# Altium project VIRB.PrjPcb
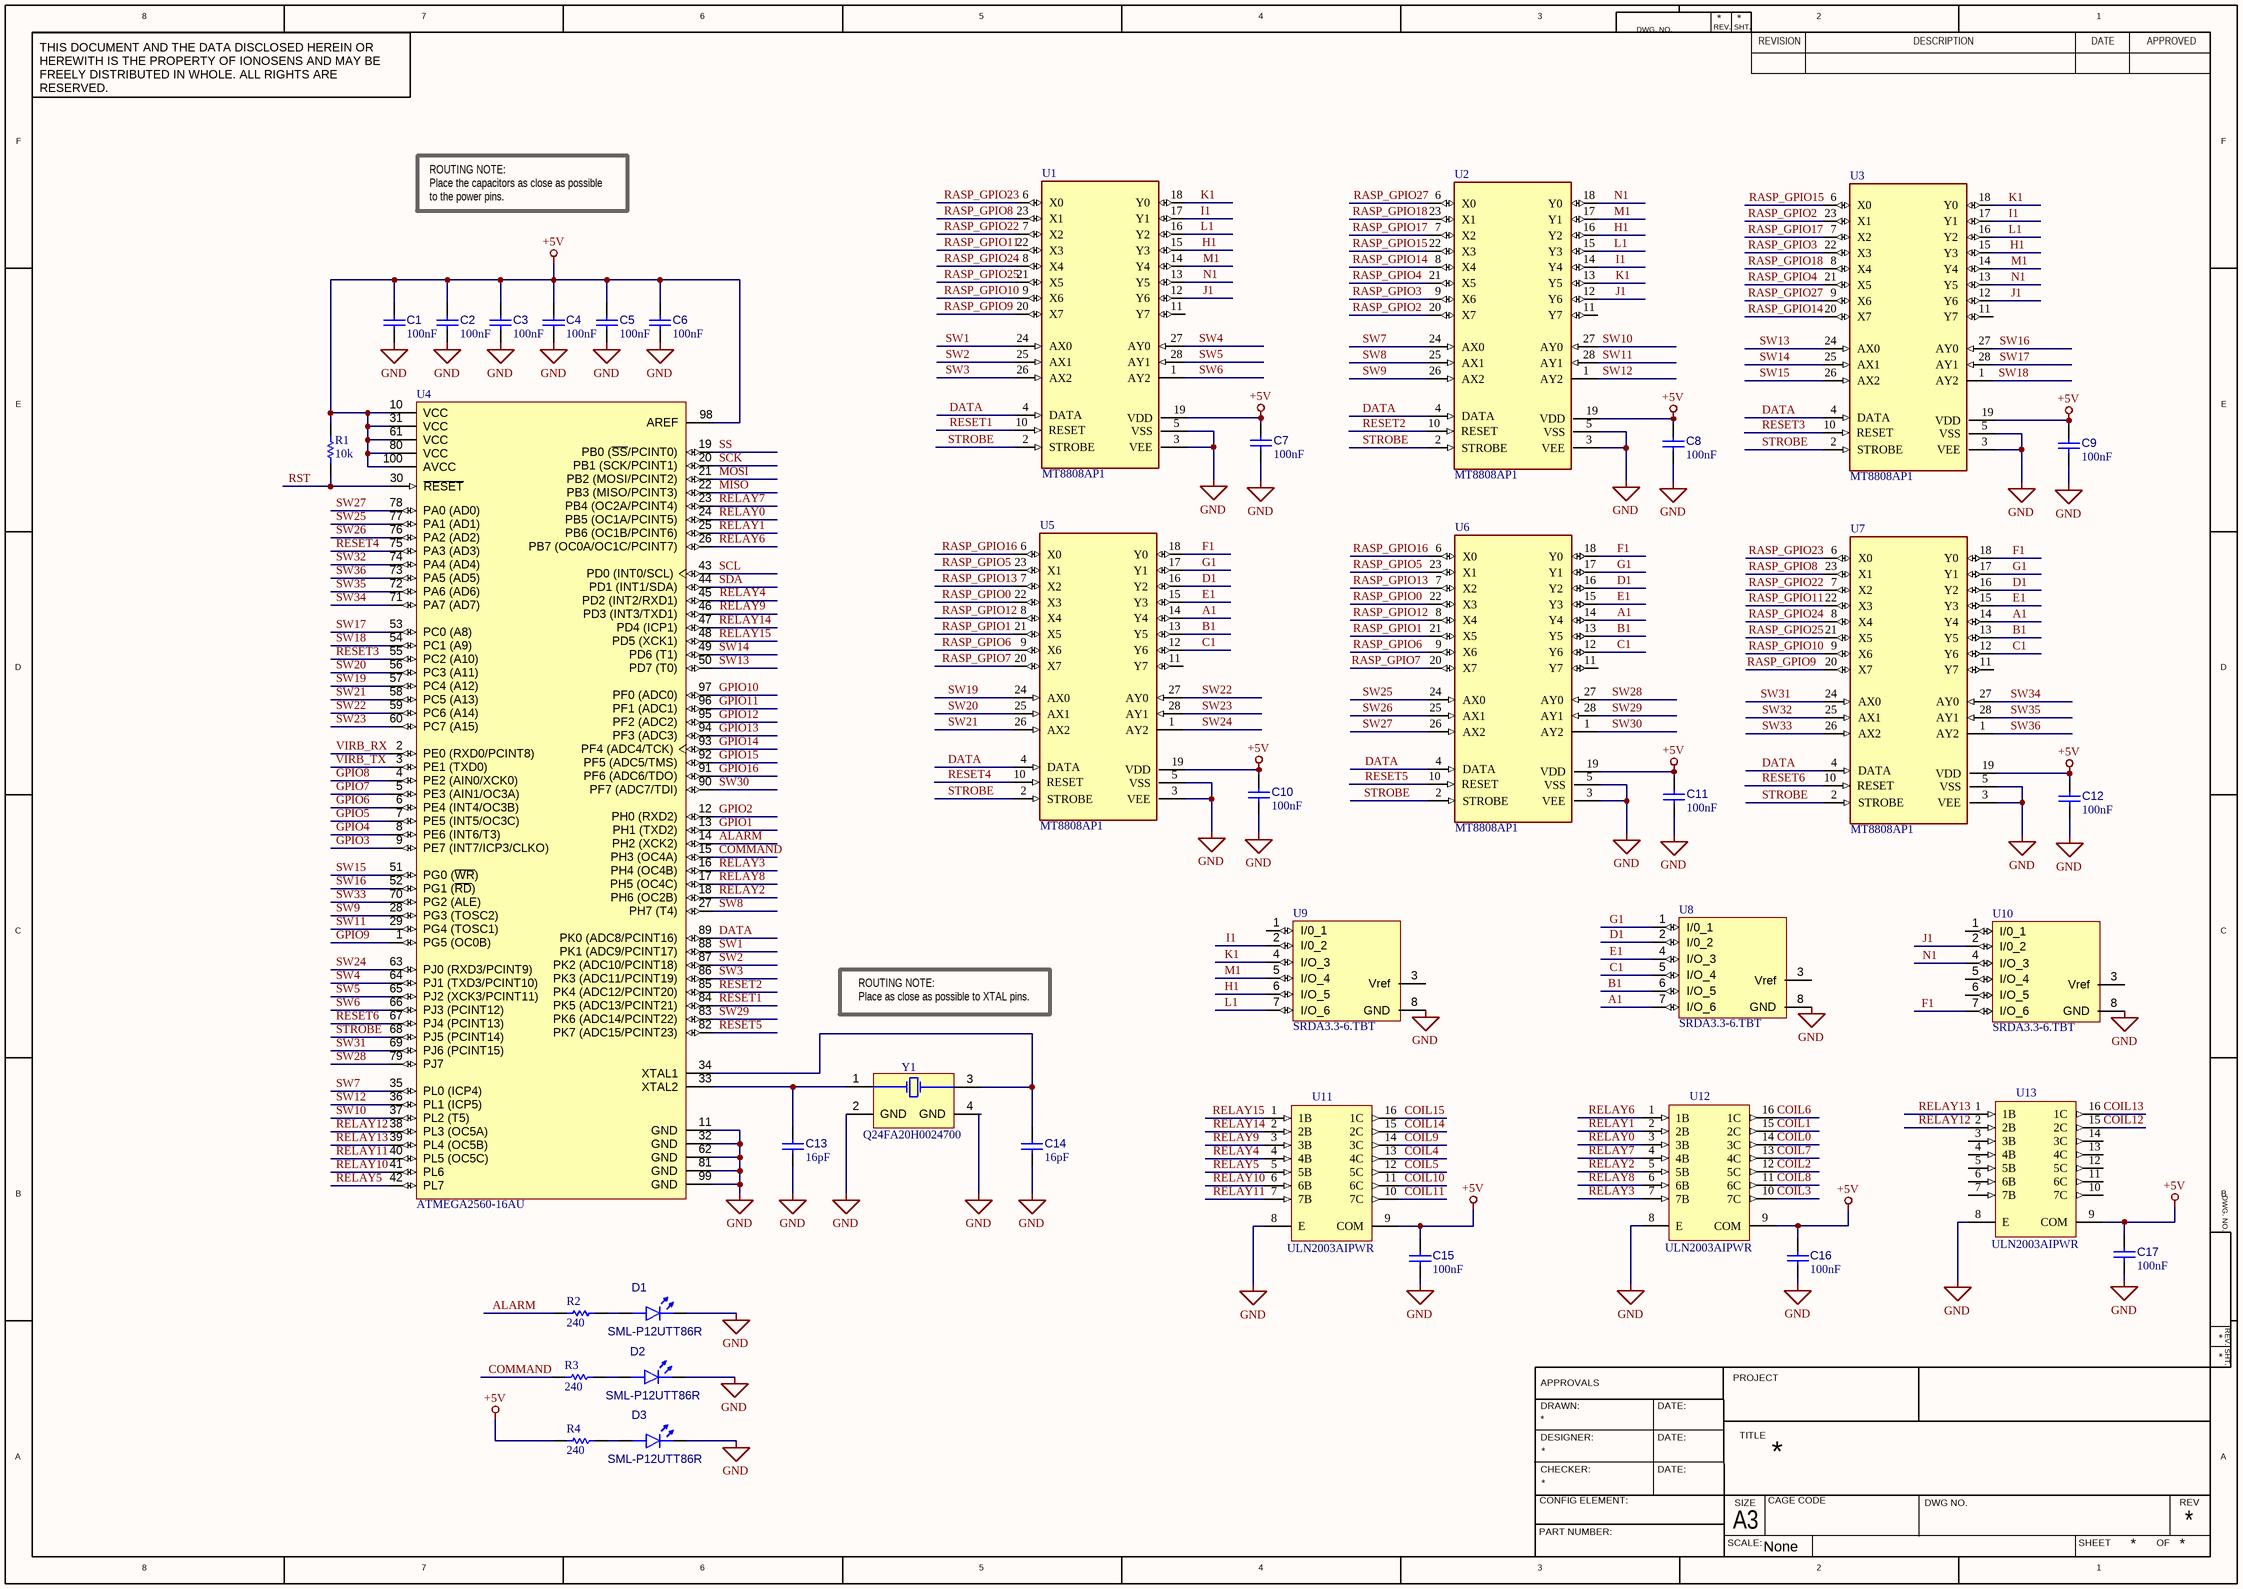
[diagram p0: Sheet1.SchDoc]
3 sheets, 103 parts. Net scope: global (net labels, ports and power ports of the same name join across sheets).
Board file: PCB1.PcbDoc
Sheets:
  Sheet1.SchDoc
  Sheet2.SchDoc
  Sheet3.SchDoc

## Sheet Sheet1.SchDoc
size 420 x 297 mm; Scale: None

### Parts
C1  value 100nF  [CAPC1005X06M]  (hidden comment: CC0402JRX7R7BB104)
C2  value 100nF  [CAPC1005X06M]  (hidden comment: CC0402JRX7R7BB104)
C3  value 100nF  [CAPC1005X06M]  (hidden comment: CC0402JRX7R7BB104)
C4  value 100nF  [CAPC1005X06M]  (hidden comment: CC0402JRX7R7BB104)
C5  value 100nF  [CAPC1005X06M]  (hidden comment: CC0402JRX7R7BB104)
C6  value 100nF  [CAPC1005X06M]  (hidden comment: CC0402JRX7R7BB104)
C7  value 100nF  [CAPC1005X06M]  (hidden comment: CC0402JRX7R7BB104)
C8  value 100nF  [CAPC1005X06M]  (hidden comment: CC0402JRX7R7BB104)
C9  value 100nF  [CAPC1005X06M]  (hidden comment: CC0402JRX7R7BB104)
C10  value 100nF  [CAPC1005X06M]  (hidden comment: CC0402JRX7R7BB104)
C11  value 100nF  [CAPC1005X06M]  (hidden comment: CC0402JRX7R7BB104)
C12  value 100nF  [CAPC1005X06M]  (hidden comment: CC0402JRX7R7BB104)
C13  value 16pF  [CAPC1005X06M]  (hidden comment: CC0402JRNPO9BN160)
C14  value 16pF  [CAPC1005X06M]  (hidden comment: CC0402JRNPO9BN160)
C15  value 100nF  [CAPC1005X06M]  (hidden comment: CC0402JRX7R7BB104)
C16  value 100nF  [CAPC1005X06M]  (hidden comment: CC0402JRX7R7BB104)
C17  value 100nF  [CAPC1005X06M]  (hidden comment: CC0402JRX7R7BB104)
D1  SML-P12UTT86R  [DIOC1005X02R]
D2  SML-P12UTT86R  [DIOC1005X02R]
D3  SML-P12UTT86R  [DIOC1005X02R]
R1  value 10k  [RESC1005X04M]  (hidden comment: AC0402FR-0710KL)
R2  value 240  [RESC1005X04M]  (hidden comment: AC0402FR-07240RL)
R3  value 240  [RESC1005X04M]  (hidden comment: AC0402FR-07240RL)
R4  value 240  [RESC1005X04M]  (hidden comment: AC0402FR-07240RL)
U1  MT8808AP1  [PLCC127P1244X1244X457-28M]
U2  MT8808AP1  [PLCC127P1244X1244X457-28M]
U3  MT8808AP1  [PLCC127P1244X1244X457-28M]
U4  ATMEGA2560-16AU  [ATML-100A_M]
U5  MT8808AP1  [PLCC127P1244X1244X457-28M]
U6  MT8808AP1  [PLCC127P1244X1244X457-28M]
U7  MT8808AP1  [PLCC127P1244X1244X457-28M]
U8  SRDA3.3-6.TBT  [SOIC127P600X175-8M]
U9  SRDA3.3-6.TBT  [SOIC127P600X175-8M]
U10  SRDA3.3-6.TBT  [SOIC127P600X175-8M]
U11  ULN2003AIPWR  [TSOP65P640X120-16M]
U12  ULN2003AIPWR  [TSOP65P640X120-16M]
U13  ULN2003AIPWR  [TSOP65P640X120-16M]
Y1  Q24FA20H0024700  [FA-20H]

### Nets
+5V: C1.2 C2.2 C3.2 C4.2 C5.2 C6.2 C7.2 C8.2 C9.2 C10.2 C11.2 C12.2 C15.2 C16.2 C17.2 R1.2 R4.1 U1.19(VDD) U2.19(VDD) U3.19(VDD) U4.10(VCC) U4.31(VCC) U4.61(VCC) U4.80(VCC) U4.98(AREF) U4.100(AVCC) U5.19(VDD) U6.19(VDD) U7.19(VDD) U11.9(COM) U12.9(COM) U13.9(COM)
GND: C1.1 C2.1 C3.1 C4.1 C5.1 C6.1 C7.1 C8.1 C9.1 C10.1 C11.1 C12.1 C13.1 C14.1 C15.1 C16.1 C17.1 D1.1(K) D2.1(K) D3.1(K) U1.3(VEE) U1.5(VSS) U2.3(VEE) U2.5(VSS) U3.3(VEE) U3.5(VSS) U4.11(GND) U4.32(GND) U4.62(GND) U4.81(GND) U4.99(GND) U5.3(VEE) U5.5(VSS) U6.3(VEE) U6.5(VSS) U7.3(VEE) U7.5(VSS) U8.8(GND) U9.8(GND) U10.8(GND) U11.8(E) U12.8(E) U13.8(E) Y1.2(GND) Y1.4(GND)
A1: U5.14(Y4) U6.14(Y4) U7.14(Y4) U8.7(I/O_6)
ALARM: R2.1 U4.14(PH2_(XCK2))
B1: U5.13(Y5) U6.13(Y5) U7.13(Y5) U8.6(I/O_5)
C1: U5.12(Y6) U6.12(Y6) U7.12(Y6) U8.5(I/O_4)
COIL0: U12.14(3C)
COIL1: U12.15(2C)
COIL2: U12.12(5C)
COIL3: U12.10(7C)
COIL4: U11.13(4C)
COIL5: U11.12(5C)
COIL6: U12.16(1C)
COIL7: U12.13(4C)
COIL8: U12.11(6C)
COIL9: U11.14(3C)
COIL10: U11.11(6C)
COIL11: U11.10(7C)
COIL12: U13.15(2C)
COIL13: U13.16(1C)
COIL14: U11.15(2C)
COIL15: U11.16(1C)
COMMAND: R3.1 U4.15(PH3_(OC4A))
D1: U5.16(Y2) U6.16(Y2) U7.16(Y2) U8.2(I/0_2)
DATA: U1.4(DATA) U2.4(DATA) U3.4(DATA) U4.89(PK0_(ADC8/PCINT16)) U5.4(DATA) U6.4(DATA) U7.4(DATA)
E1: U5.15(Y3) U6.15(Y3) U7.15(Y3) U8.4(I/O_3)
F1: U5.18(Y0) U6.18(Y0) U7.18(Y0) U10.7(I/O_6)
G1: U5.17(Y1) U6.17(Y1) U7.17(Y1) U8.1(I/0_1)
GPIO1: U4.13(PH1_(TXD2))
GPIO2: U4.12(PH0_(RXD2))
GPIO3: U4.9(PE7_(INT7/ICP3/CLKO))
GPIO4: U4.8(PE6_(INT6/T3))
GPIO5: U4.7(PE5_(INT5/OC3C))
GPIO6: U4.6(PE4_(INT4/OC3B))
GPIO7: U4.5(PE3_(AIN1/OC3A))
GPIO8: U4.4(PE2_(AIN0/XCK0))
GPIO9: U4.1(PG5_(OC0B))
GPIO10: U4.97(PF0_(ADC0))
GPIO11: U4.96(PF1_(ADC1))
GPIO12: U4.95(PF2_(ADC2))
GPIO13: U4.94(PF3_(ADC3))
GPIO14: U4.93(PF4_(ADC4/TCK))
GPIO15: U4.92(PF5_(ADC5/TMS))
GPIO16: U4.91(PF6_(ADC6/TDO))
H1: U1.15(Y3) U2.16(Y2) U3.15(Y3) U9.6(I/O_5)
I1: U1.17(Y1) U2.14(Y4) U3.17(Y1) U9.2(I/0_2)
J1: U1.12(Y6) U2.12(Y6) U3.12(Y6) U10.2(I/0_2)
K1: U1.18(Y0) U2.13(Y5) U3.18(Y0) U9.4(I/O_3)
L1: U1.16(Y2) U2.15(Y3) U3.16(Y2) U9.7(I/O_6)
M1: U1.14(Y4) U2.17(Y1) U3.14(Y4) U9.5(I/O_4)
MISO: U4.22(PB3_(MISO/PCINT3))
MOSI: U4.21(PB2_(MOSI/PCINT2))
N1: U1.13(Y5) U2.18(Y0) U3.13(Y5) U10.4(I/O_3)
RASP_GPIO0: U5.22(X3) U6.22(X3)
RASP_GPIO1: U5.21(X5) U6.21(X5)
RASP_GPIO2: U2.20(X7) U3.23(X1)
RASP_GPIO3: U2.9(X6) U3.22(X3)
RASP_GPIO4: U2.21(X5) U3.21(X5)
RASP_GPIO5: U5.23(X1) U6.23(X1)
RASP_GPIO6: U5.9(X6) U6.9(X6)
RASP_GPIO7: U5.20(X7) U6.20(X7)
RASP_GPIO8: U1.23(X1) U7.23(X1)
RASP_GPIO9: U1.20(X7) U7.20(X7)
RASP_GPIO10: U1.9(X6) U7.9(X6)
RASP_GPIO11: U1.22(X3) U7.22(X3)
RASP_GPIO12: U5.8(X4) U6.8(X4)
RASP_GPIO13: U5.7(X2) U6.7(X2)
RASP_GPIO14: U2.8(X4) U3.20(X7)
RASP_GPIO15: U2.22(X3) U3.6(X0)
RASP_GPIO16: U5.6(X0) U6.6(X0)
RASP_GPIO17: U2.7(X2) U3.7(X2)
RASP_GPIO18: U2.23(X1) U3.8(X4)
RASP_GPIO22: U1.7(X2) U7.7(X2)
RASP_GPIO23: U1.6(X0) U7.6(X0)
RASP_GPIO24: U1.8(X4) U7.8(X4)
RASP_GPIO25: U1.21(X5) U7.21(X5)
RASP_GPIO27: U2.6(X0) U3.9(X6)
RELAY0: U4.24(PB5_(OC1A/PCINT5)) U12.3(3B)
RELAY1: U4.25(PB6_(OC1B/PCINT6)) U12.2(2B)
RELAY2: U4.18(PH6_(OC2B)) U12.5(5B)
RELAY3: U4.16(PH4_(OC4B)) U12.7(7B)
RELAY4: U4.45(PD2_(INT2/RXD1)) U11.4(4B)
RELAY5: U4.42(PL7) U11.5(5B)
RELAY6: U4.26(PB7_(OC0A/OC1C/PCINT7)) U12.1(1B)
RELAY7: U4.23(PB4_(OC2A/PCINT4)) U12.4(4B)
RELAY8: U4.17(PH5_(OC4C)) U12.6(6B)
RELAY9: U4.46(PD3_(INT3/TXD1)) U11.3(3B)
RELAY10: U4.41(PL6) U11.6(6B)
RELAY11: U4.40(PL5_(OC5C)) U11.7(7B)
RELAY12: U4.38(PL3_(OC5A)) U13.2(2B)
RELAY13: U4.39(PL4_(OC5B)) U13.1(1B)
RELAY14: U4.47(PD4_(ICP1)) U11.2(2B)
RELAY15: U4.48(PD5_(XCK1)) U11.1(1B)
RESET1: U1.10(RESET) U4.84(PK5_(ADC13/PCINT21))
RESET2: U2.10(RESET) U4.85(PK4_(ADC12/PCINT20))
RESET3: U3.10(RESET) U4.55(PC2_(A10))
RESET4: U4.75(PA3_(AD3)) U5.10(RESET)
RESET5: U4.82(PK7_(ADC15/PCINT23)) U6.10(RESET)
RESET6: U4.67(PJ4_(PCINT13)) U7.10(RESET)
RST: R1.1 U4.30(~{RESET})
SCK: U4.20(PB1_(SCK/PCINT1))
SCL: U4.43(PD0_(INT0/SCL))
SDA: U4.44(PD1_(INT1/SDA))
SS: U4.19(PB0_(~{SS}/PCINT0))
STROBE: U1.2(STROBE) U2.2(STROBE) U3.2(STROBE) U4.68(PJ5_(PCINT14)) U5.2(STROBE) U6.2(STROBE) U7.2(STROBE)
SW1: U1.24(AX0) U4.88(PK1_(ADC9/PCINT17))
SW2: U1.25(AX1) U4.87(PK2_(ADC10/PCINT18))
SW3: U1.26(AX2) U4.86(PK3_(ADC11/PCINT19))
SW4: U1.27(AY0) U4.64(PJ1_(TXD3/PCINT10))
SW5: U1.28(AY1) U4.65(PJ2_(XCK3/PCINT11))
SW6: U1.1(AY2) U4.66(PJ3_(PCINT12))
SW7: U2.24(AX0) U4.35(PL0_(ICP4))
SW8: U2.25(AX1) U4.27(PH7_(T4))
SW9: U2.26(AX2) U4.28(PG3_(TOSC2))
SW10: U2.27(AY0) U4.37(PL2_(T5))
SW11: U2.28(AY1) U4.29(PG4_(TOSC1))
SW12: U2.1(AY2) U4.36(PL1_(ICP5))
SW13: U3.24(AX0) U4.50(PD7_(T0))
SW14: U3.25(AX1) U4.49(PD6_(T1))
SW15: U3.26(AX2) U4.51(PG0_(~{WR}))
SW16: U3.27(AY0) U4.52(PG1_(~{RD}))
SW17: U3.28(AY1) U4.53(PC0_(A8))
SW18: U3.1(AY2) U4.54(PC1_(A9))
SW19: U4.57(PC4_(A12)) U5.24(AX0)
SW20: U4.56(PC3_(A11)) U5.25(AX1)
SW21: U4.58(PC5_(A13)) U5.26(AX2)
SW22: U4.59(PC6_(A14)) U5.27(AY0)
SW23: U4.60(PC7_(A15)) U5.28(AY1)
SW24: U4.63(PJ0_(RXD3/PCINT9)) U5.1(AY2)
SW25: U4.77(PA1_(AD1)) U6.24(AX0)
SW26: U4.76(PA2_(AD2)) U6.25(AX1)
SW27: U4.78(PA0_(AD0)) U6.26(AX2)
SW28: U4.79(PJ7) U6.27(AY0)
SW29: U4.83(PK6_(ADC14/PCINT22)) U6.28(AY1)
SW30: U4.90(PF7_(ADC7/TDI)) U6.1(AY2)
SW31: U4.69(PJ6_(PCINT15)) U7.24(AX0)
SW32: U4.74(PA4_(AD4)) U7.25(AX1)
SW33: U4.70(PG2_(ALE)) U7.26(AX2)
SW34: U4.71(PA7_(AD7)) U7.27(AY0)
SW35: U4.72(PA6_(AD6)) U7.28(AY1)
SW36: U4.73(PA5_(AD5)) U7.1(AY2)
VIRB_RX: U4.2(PE0_(RXD0/PCINT8))
VIRB_TX: U4.3(PE1_(TXD0))
NetC13_2: C13.2 U4.33(XTAL2) Y1.1(X1)
NetC14_2: C14.2 U4.34(XTAL1) Y1.3(X2)
NetD1_2: D1.2(A) R2.2
NetD2_2: D2.2(A) R3.2
NetD3_2: D3.2(A) R4.2

Not connected (* = marked no-connect by the designer): U1 11(Y7); U2 11(Y7); U3 11(Y7); U5 11(Y7); U6 11(Y7); U7 11(Y7); U8 3(Vref); U9 1(I/0_1) 3(Vref); U10 1(I/0_1) 3(Vref) 5(I/O_4) 6(I/O_5); U13 3(3B) 4(4B) 5(5B) 6(6B) 7(7B) 10(7C) 11(6C) 12(5C) 13(4C) 14(3C)

### Notes on the sheet
- ROUTING NOTE:
  Place the capacitors as close as possible to the power pins.
- ROUTING NOTE:
  Place as close as possible to XTAL pins.
- 8
- 7
- 6
- 5
- 4
- 3
- DWG. NO.
- REV.
- SHT.
- REVISION
- 2
- DESCRIPTION
- DATE
- 1
- APPROVED
- THIS DOCUMENT AND THE DATA DISCLOSED HEREIN OR HEREWITH IS THE PROPERTY OF IONOSENS AND MAY BE FREELY DISTRIBUTED IN WHOLE. ALL RIGHTS ARE RESERVED.
- F
- E
- D
- C
- B
- DRAWN:
- APPROVALS
- DATE:
- PROJECT
- A
- CHECKER:
- DESIGNER:
- TITLE
- PART NUMBER:
- CONFIG ELEMENT:
- SCALE:
- A3
- SIZE
- CAGE CODE
- DWG NO.
- SHEET
- OF
- REV

### Library data of the parts
C1-C12 C15-C17 = C01-0402-01-00001-1: Cap Ceramic 100nF 50V X7R 5% SMD 0402 125°C; Manufacturer: YAGEO; Voltage Rating: 16V; Case/Package: 0402; Capacitor Type: Ceramic; Min Operating Temperature: -55°C; Width: 508µm; Length: 1mm; Tolerance: 5%; Dielectric: X7R; RoHS Compliant: Yes; Pins: 2; Composition: Ceramic; Depth: 500µm; Voltage Rating (DC): 16V; Mount: Surface Mount; Mounting Technology: Surface Mount; Termination: SMD/SMT; Manufacturer P/N: CC0402JRX7R7BB104; Thickness: 558.8µm; Max Operating Temperature: 125°C
C13 C14 = C01-0402-01-00000-2: Cap Ceramic 16pF 50V C0G 5% SMD 0402 125°C; Manufacturer: YAGEO; Dielectric: COG; Depth: 500µm; Mount: Surface Mount; Voltage Rating (DC): 50V; Width: 508µm; Pins: 2; Manufacturer P/N: CC0402JRNPO9BN160; Length: 990.6µm; Composition: Ceramic; Thickness: 558.8µm; Mounting Technology: Surface Mount; RoHS Compliant: Yes; Voltage Rating: 50V; Termination: SMD/SMT; Tolerance: 5%; Capacitor Type: Ceramic; Min Operating Temperature: -55°C; Max Operating Temperature: 125°C; Case/Package: 0402
D1-D3 = D01-0402-01-00001-1: Led red 0402; Manufacturer: ROHM; Number of LEDs: 1; Max Power Dissipation: 52mW; Luminous Intensity: 85 mcd; Dominant Wavelength: 620 nm; Lens Style: Rectangular, Square; Forward Current: 20 mA; Forward Voltage: 2V; Mounting Technology: SMD; Case/Package: 0402; Min Operating Temperature: -40°C; Max Operating Temperature: 85°C; Manufacturer P/N: SML-P12UTT86R; Colour: red; RoHS Compliant: Yes; Pins: 2
R1 = R01-0402-01-00169-2: RES SMD 10K OHM 1% 1/16W 0402; Manufacturer: Yageo; Temperature Coefficient: 100 ppm/ºC; Power Rating: 62.5mW; Voltage Rating: 50V; Length: 990.6µm; Height: 370µm; Min Operating Temperature: -55°C; Case/Package: 0402; Features: Automotive AEC-Q200, Moisture Resistant; Packaging: Tape & Reel; Width: 508µm; Manufacturer P/N: AC0402FR-0710KL; RoHS: Yes; Max Operating Temperature: 155°C; Tolerance: 1%; Composition: Thick Film; Number of Terminations: 2
R2-R4 = R01-0402-01-00437-2: RES SMD 240 OHM 1% 1/16W 0402; Manufacturer: Yageo; Temperature Coefficient: 100 ppm/ºC; Power Rating: 62.5mW; Voltage Rating: 50V; Packaging: Tape & Reel; Manufacturer P/N: AC0402FR-07240RL; Height: 370µm; Case/Package: 0402; Composition: Thick Film; Max Operating Temperature: 155°C; Number of Terminations: 2; RoHS: Yes; Min Operating Temperature: -55°C; Tolerance: 1%; Width: 508µm; Length: 990.6µm; Features: Automotive AEC-Q200, Moisture Resistant
U1-U3 U5-U7 = CMP-0007-0001-00001-1: 8 x 8 Analog Switch Array with Low On-resistance, for (VDD - VEE) = 4.5 to 13.2V; Manufacturer: Microchip; Number of Inputs: 8; Max Supply Voltage: 85V; On-State Resistance: 65; Min Supply Voltage: 4.5; Output Current: 15mA; Number of Outputs: 8; Length: 11.58mm; Manufacturer P/N: MT8808AP1; Mounting Technology: SMD; Pins: 28; Max Operating Temperature: 13.2°C; Number of Elements: 8; Min Operating Temperature: -40°C; Width: 11.58mm; Height: 4.57mm; RoHS Compliant: yes; Case/Package: PLLC
U4 = U01-0007-01-00000-1: AVR ATmega Microcontroller 8-bit 16MHz 256KB FLASH TQFP100; Manufacturer: Microchip; Oscillator Type: External; Interface: I2C, SPI, UART; Minimum Supply Voltage: 4.5V; Peripherals: Brown-out Detect/Reset, POR, PWM, WDT; Number of A/D: 1 AD / 16 channels; Watchdog Timer: Yes; Number of I/O: 86; RAM Size: 8KB; Max Supply Voltage: 5.5V; Max Operating Temperature: 85°C; Manufacturer P/N: ATMEGA2560-16AU; Memory Size: 256KB; Mounting Technology: SMD; Memory Type: FLASH; Pins: 100; Height: 1.2mm; Case/Package: A; RoHS: Yes; Min Operating Temperature: -40°C; Max Frequency: 16MHz; Number of Programmable I/O: 86; Contact Plating: Tin; Core Architecture: AVR; Frequency: 16MHz; Width: 16.25mm
U8-U10 = CMP-0005-0001-00000-1: SRDA Series 15 V 8 pF SMT RailClamp® Low Capacitance TVS Diode Array - SOIC-8; Manufacturer: Semtech; Number of Channels: 6; Peak Pulse Current: 25A; Max Breakdown Voltage: 6V; Max Power Dissipation: 500W; Direction: Unidirectional; Clamping Voltage: 15V; Capacitance: 8pF; Breakdown Voltage: 3.2V; Leakage Current: 1µV; Manufacturer P/N: SRDA3.3-6.TBT; Height: 1.75mm; Case/Package: so-8; Pins: 8; Length: 5mm; Min Operating Temperature: -55°C; Mounting Technology: SMD; Max Operating Temperature: 125°C; RoHS Compliant: yes; Width: 4mm
U11-U13 = CMP-0005-0001-00001-1: 50-V, 7-ch darlington transistor array, -40 to 105C 16-TSSOP -40 to 105; Manufacturer: Texas Instruments; Voltage Rating: 50V; Min Operating Temperature: 105°C; RoHS Compliant: yes; Pins: 16; Case/Package: TSSOP; Mounting Technology: SMD; Length: 5mm; Manufacturer P/N: ULN2003AIPWR; Height: 1.2mm; Max Operating Temperature: -40°C; Width: 4.4mm
Y1 = Y01-0001-01-00000-11: 16MHz ±10ppm 16pF 80Ω SMD-2520_4P; Manufacturer: SEIKO-EPSON; ESR: 80; RoHS Compliant: yes; Min Operating Temperature: -40°C; Load Capacitance: 16pF; Mounting Technology: SMD; Pins: 4; Case/Package: SMD-2520_4P; Max Operating Temperature: 85°C; Frequency: 16MHz; Manufacturer P/N: Q24FA20H0024700

## Sheet Sheet2.SchDoc
size 420 x 297 mm
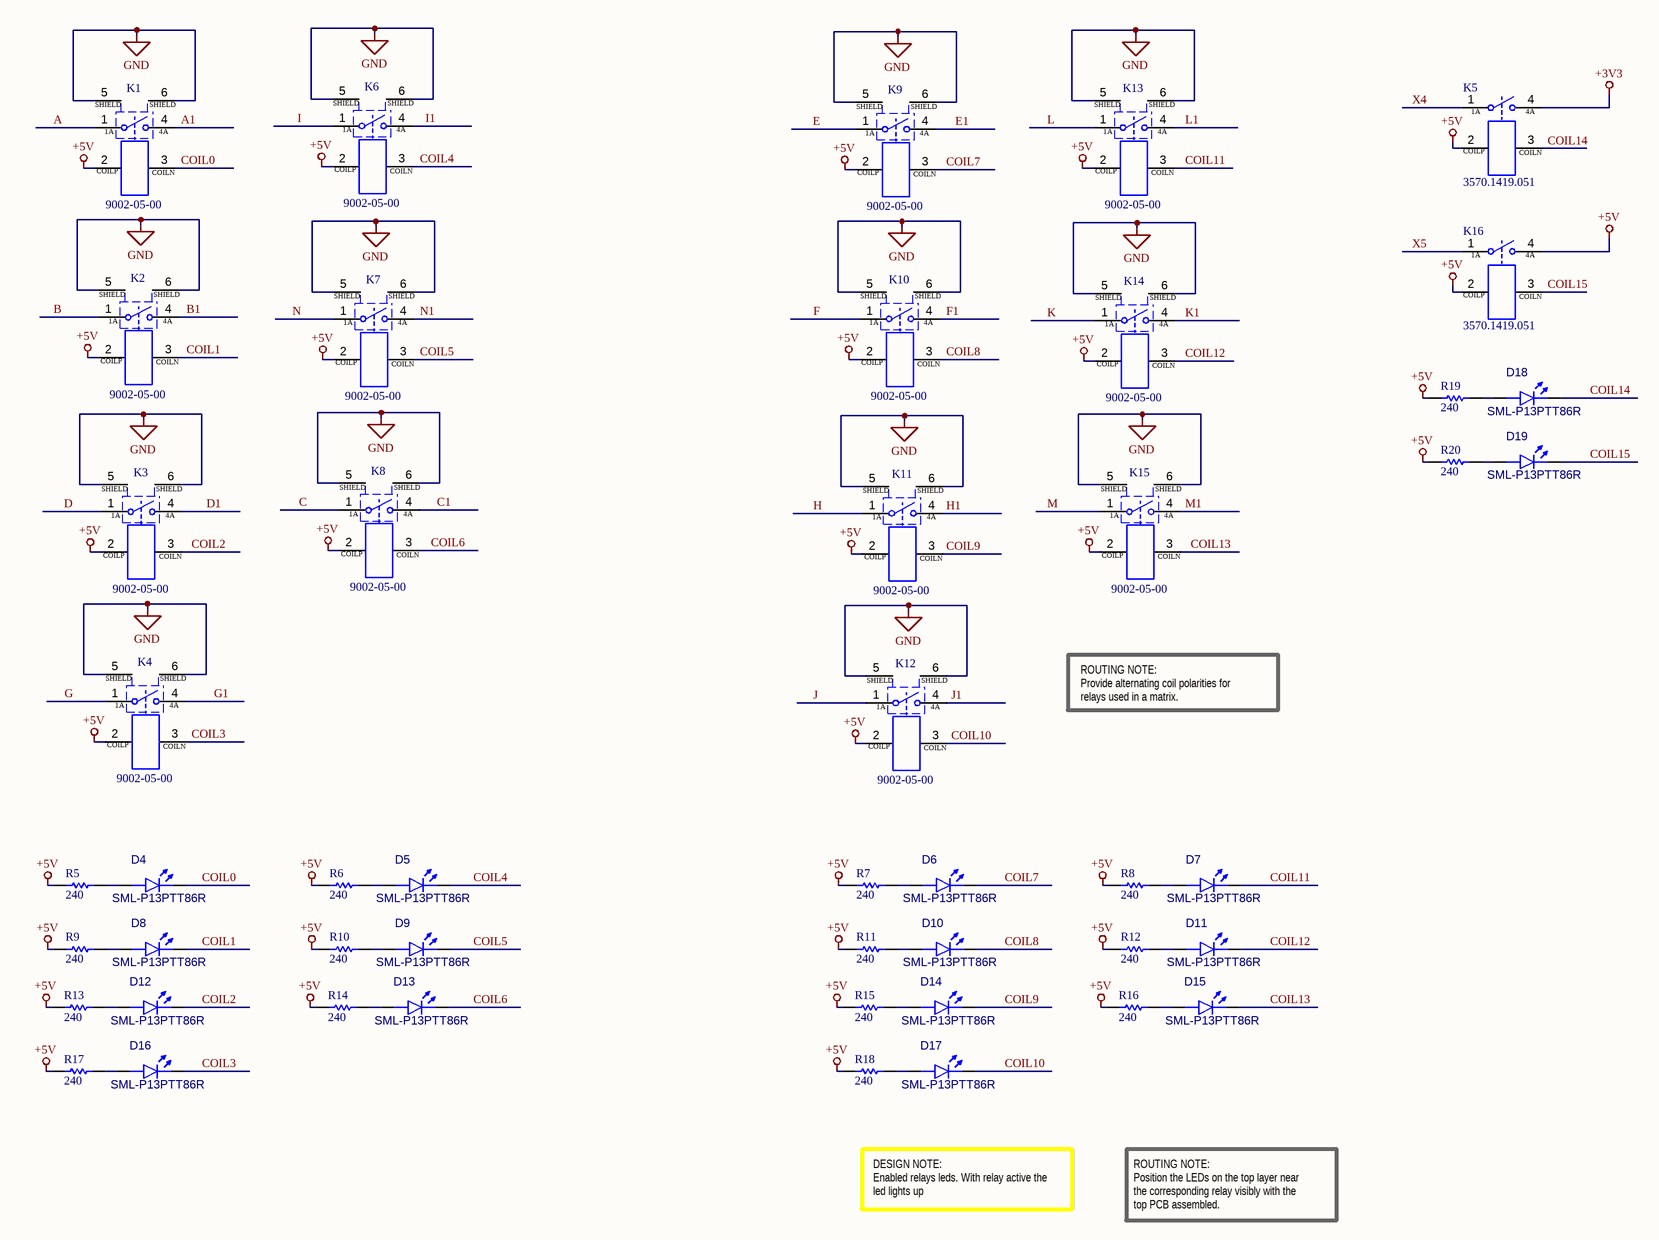
[diagram p1: Sheet2.SchDoc]

### Parts
D4  SML-P13PTT86R  [DIOC1005X02R]
D5  SML-P13PTT86R  [DIOC1005X02R]
D6  SML-P13PTT86R  [DIOC1005X02R]
D7  SML-P13PTT86R  [DIOC1005X02R]
D8  SML-P13PTT86R  [DIOC1005X02R]
D9  SML-P13PTT86R  [DIOC1005X02R]
D10  SML-P13PTT86R  [DIOC1005X02R]
D11  SML-P13PTT86R  [DIOC1005X02R]
D12  SML-P13PTT86R  [DIOC1005X02R]
D13  SML-P13PTT86R  [DIOC1005X02R]
D14  SML-P13PTT86R  [DIOC1005X02R]
D15  SML-P13PTT86R  [DIOC1005X02R]
D16  SML-P13PTT86R  [DIOC1005X02R]
D17  SML-P13PTT86R  [DIOC1005X02R]
D18  SML-P13PTT86R  [DIOC1005X02R]
D19  SML-P13PTT86R  [DIOC1005X02R]
K1  9002-05-00  [SIP564W40P254L1980H810Q6 - Cloned]
K2  9002-05-00  [SIP564W40P254L1980H810Q6 - Cloned]
K3  9002-05-00  [SIP564W40P254L1980H810Q6 - Cloned]
K4  9002-05-00  [SIP564W40P254L1980H810Q6 - Cloned]
K5  3570.1419.051  [3570.1419]
K6  9002-05-00  [SIP564W40P254L1980H810Q6 - Cloned]
K7  9002-05-00  [SIP564W40P254L1980H810Q6 - Cloned]
K8  9002-05-00  [SIP564W40P254L1980H810Q6 - Cloned]
K9  9002-05-00  [SIP564W40P254L1980H810Q6 - Cloned]
K10  9002-05-00  [SIP564W40P254L1980H810Q6 - Cloned]
K11  9002-05-00  [SIP564W40P254L1980H810Q6 - Cloned]
K12  9002-05-00  [SIP564W40P254L1980H810Q6 - Cloned]
K13  9002-05-00  [SIP564W40P254L1980H810Q6 - Cloned]
K14  9002-05-00  [SIP564W40P254L1980H810Q6 - Cloned]
K15  9002-05-00  [SIP564W40P254L1980H810Q6 - Cloned]
K16  3570.1419.051  [3570.1419]
R5  value 240  [RESC1005X04M]  (hidden comment: AC0402FR-07240RL)
R6  value 240  [RESC1005X04M]  (hidden comment: AC0402FR-07240RL)
R7  value 240  [RESC1005X04M]  (hidden comment: AC0402FR-07240RL)
R8  value 240  [RESC1005X04M]  (hidden comment: AC0402FR-07240RL)
R9  value 240  [RESC1005X04M]  (hidden comment: AC0402FR-07240RL)
R10  value 240  [RESC1005X04M]  (hidden comment: AC0402FR-07240RL)
R11  value 240  [RESC1005X04M]  (hidden comment: AC0402FR-07240RL)
R12  value 240  [RESC1005X04M]  (hidden comment: AC0402FR-07240RL)
R13  value 240  [RESC1005X04M]  (hidden comment: AC0402FR-07240RL)
R14  value 240  [RESC1005X04M]  (hidden comment: AC0402FR-07240RL)
R15  value 240  [RESC1005X04M]  (hidden comment: AC0402FR-07240RL)
R16  value 240  [RESC1005X04M]  (hidden comment: AC0402FR-07240RL)
R17  value 240  [RESC1005X04M]  (hidden comment: AC0402FR-07240RL)
R18  value 240  [RESC1005X04M]  (hidden comment: AC0402FR-07240RL)
R19  value 240  [RESC1005X04M]  (hidden comment: AC0402FR-07240RL)
R20  value 240  [RESC1005X04M]  (hidden comment: AC0402FR-07240RL)

### Nets
+3V3: K5.4(4A)
+5V: K1.2(COILP) K2.2(COILP) K3.2(COILP) K4.2(COILP) K5.2(COILP) K6.2(COILP) K7.2(COILP) K8.2(COILP) K9.2(COILP) K10.2(COILP) K11.2(COILP) K12.2(COILP) K13.2(COILP) K14.2(COILP) K15.2(COILP) K16.2(COILP) K16.4(4A) R5.1 R6.1 R7.1 R8.1 R9.1 R10.1 R11.1 R12.1 R13.1 R14.1 R15.1 R16.1 R17.1 R18.1 R19.1 R20.1
GND: K1.5(Shield) K1.6(Shield) K2.5(Shield) K2.6(Shield) K3.5(Shield) K3.6(Shield) K4.5(Shield) K4.6(Shield) K6.5(Shield) K6.6(Shield) K7.5(Shield) K7.6(Shield) K8.5(Shield) K8.6(Shield) K9.5(Shield) K9.6(Shield) K10.5(Shield) K10.6(Shield) K11.5(Shield) K11.6(Shield) K12.5(Shield) K12.6(Shield) K13.5(Shield) K13.6(Shield) K14.5(Shield) K14.6(Shield) K15.5(Shield) K15.6(Shield)
A: K1.1(1A)
A1: K1.4(4A)
B: K2.1(1A)
B1: K2.4(4A)
C: K8.1(1A)
C1: K8.4(4A)
COIL0: D4.1(K) K1.3(COILN)
COIL1: D8.1(K) K2.3(COILN)
COIL2: D12.1(K) K3.3(COILN)
COIL3: D16.1(K) K4.3(COILN)
COIL4: D5.1(K) K6.3(COILN)
COIL5: D9.1(K) K7.3(COILN)
COIL6: D13.1(K) K8.3(COILN)
COIL7: D6.1(K) K9.3(COILN)
COIL8: D10.1(K) K10.3(COILN)
COIL9: D14.1(K) K11.3(COILN)
COIL10: D17.1(K) K12.3(COILN)
COIL11: D7.1(K) K13.3(COILN)
COIL12: D11.1(K) K14.3(COILN)
COIL13: D15.1(K) K15.3(COILN)
COIL14: D18.1(K) K5.3(COILN)
COIL15: D19.1(K) K16.3(COILN)
D: K3.1(1A)
D1: K3.4(4A)
E: K9.1(1A)
E1: K9.4(4A)
F: K10.1(1A)
F1: K10.4(4A)
G: K4.1(1A)
G1: K4.4(4A)
H: K11.1(1A)
H1: K11.4(4A)
I: K6.1(1A)
I1: K6.4(4A)
J: K12.1(1A)
J1: K12.4(4A)
K: K14.1(1A)
K1: K14.4(4A)
L: K13.1(1A)
L1: K13.4(4A)
M: K15.1(1A)
M1: K15.4(4A)
N: K7.1(1A)
N1: K7.4(4A)
X4: K5.1(1A)
X5: K16.1(1A)
NetD4_2: D4.2(A) R5.2
NetD5_2: D5.2(A) R6.2
NetD6_2: D6.2(A) R7.2
NetD7_2: D7.2(A) R8.2
NetD8_2: D8.2(A) R9.2
NetD9_2: D9.2(A) R10.2
NetD10_2: D10.2(A) R11.2
NetD11_2: D11.2(A) R12.2
NetD12_2: D12.2(A) R13.2
NetD13_2: D13.2(A) R14.2
NetD14_2: D14.2(A) R15.2
NetD15_2: D15.2(A) R16.2
NetD16_2: D16.2(A) R17.2
NetD17_2: D17.2(A) R18.2
NetD18_2: D18.2(A) R19.2
NetD19_2: D19.2(A) R20.2

### Notes on the sheet
- ROUTING NOTE:
  Provide alternating coil polarities for relays used in a matrix.
- DESIGN NOTE:
  Enabled relays leds. With relay active the led lights up
- ROUTING NOTE:
  Position the LEDs on the top layer near the corresponding relay visibly with the top PCB assembled.
- 8
- 7
- 6
- 5
- 4
- 3
- DWG. NO.
- REV.
- SHT.
- REVISION
- 2
- DESCRIPTION
- DATE
- 1
- APPROVED
- THIS DOCUMENT AND THE DATA DISCLOSED HEREIN OR HEREWITH IS THE PROPERTY OF IONOSENS AND MAY BE FREELY DISTRIBUTED IN WHOLE. ALL RIGHTS ARE RESERVED.
- F
- E
- D
- C
- B
- A
- SCALE:
- A3
- SIZE
- CAGE CODE
- DWG NO.
- SHEET
- OF
- REV
- (in symbol K01-0008-01-00002-6) SHIELD

### Library data of the parts
D4-D19 = D01-0402-01-00000-1: Led green 0402; Manufacturer: ROHM; Forward Voltage: 2.1V; Max Power Dissipation: 52mW; Forward Current: 20 mA; Number of LEDs: 1; Dominant Wavelength: 560 nm; Luminous Intensity: 10 mcd; Lens Style: Rectangular, Square; Min Operating Temperature: -40°C; Mounting Technology: SMD; Colour: Green; Manufacturer P/N: SML-P13PTT86R; Max Operating Temperature: 85°C; Pins: 2; RoHS Compliant: Yes; Case/Package: 0402
K1-K4 K6-K15 = K01-0008-01-00002-6: Reed Relay 5VDC 350Ohm 0.5A SPST-NO THT; Manufacturer: COTO; Rise time: 350µs; Coil Current: 14.28mA; Release Time: 100µs; Number of Terminal: 6; Contact Form: SPST; Insulation Resistance: 1T; Coil Type: Non-Latching; Coil Voltage (DC): 5V; Contact Current Rating: 500mA; Contact Resistence: 0.2; Switching Voltage: 200V; Coil resitence: 350; Relay Type: RF; Mounting Technology: Through Hole; Case/Package: SIP; Contact Material: Ruthenium; Packaging: Bulk; Width: 19.3mm; Height: 7.6mm; Max Operating Temperature: 85°C; RoHS: Yes; Min Operating Temperature: -20°C; Pins: 6; Switching Current: 500mA; Operate Time: 350µs; Manufacturer P/N: 9002-05-00
K5 K16 = K01-0008-01-00008-1: Reed Relay, Mini SIP, 5 VDC; 1 Form A, 15W, 200 VDC, 1.25A; Manufacturer: Comus; Number of Terminal: 4; Contact Current Rating: 1A; Coil Current: 10mA; Switching Voltage: 200V; Rise time: 0s; Contact Resistence: 0.15; Coil resitence: 500; Operate Time: 350µs; Coil Voltage (DC): 5V; Insulation Resistance: 0; Release Time: 100µs; Manufacturer P/N: 3570.1419.051; Mounting Technology: TH; Contact Material: -; Relay Type: Reed; Width: 15.24mm; Contact Form: 1A; Packaging: SIP; Switching Current: 1A; Pins: 4; Case/Package: SIP; Coil Type: -; Min Operating Temperature: -40°C; RoHS: Yes; Height: 6.98mm; Max Operating Temperature: 85°C
R5-R20 = R01-0402-01-00437-2: as R2 on sheet Sheet1; Packaging: Tape & Reel; Manufacturer P/N: AC0402FR-07240RL; Height: 370µm; Case/Package: 0402; Composition: Thick Film; Max Operating Temperature: 155°C; Number of Terminations: 2; RoHS: Yes; Min Operating Temperature: -55°C; Tolerance: 1%; Width: 508µm; Length: 990.6µm; Features: Automotive AEC-Q200, Moisture Resistant

## Sheet Sheet3.SchDoc
size 420 x 297 mm
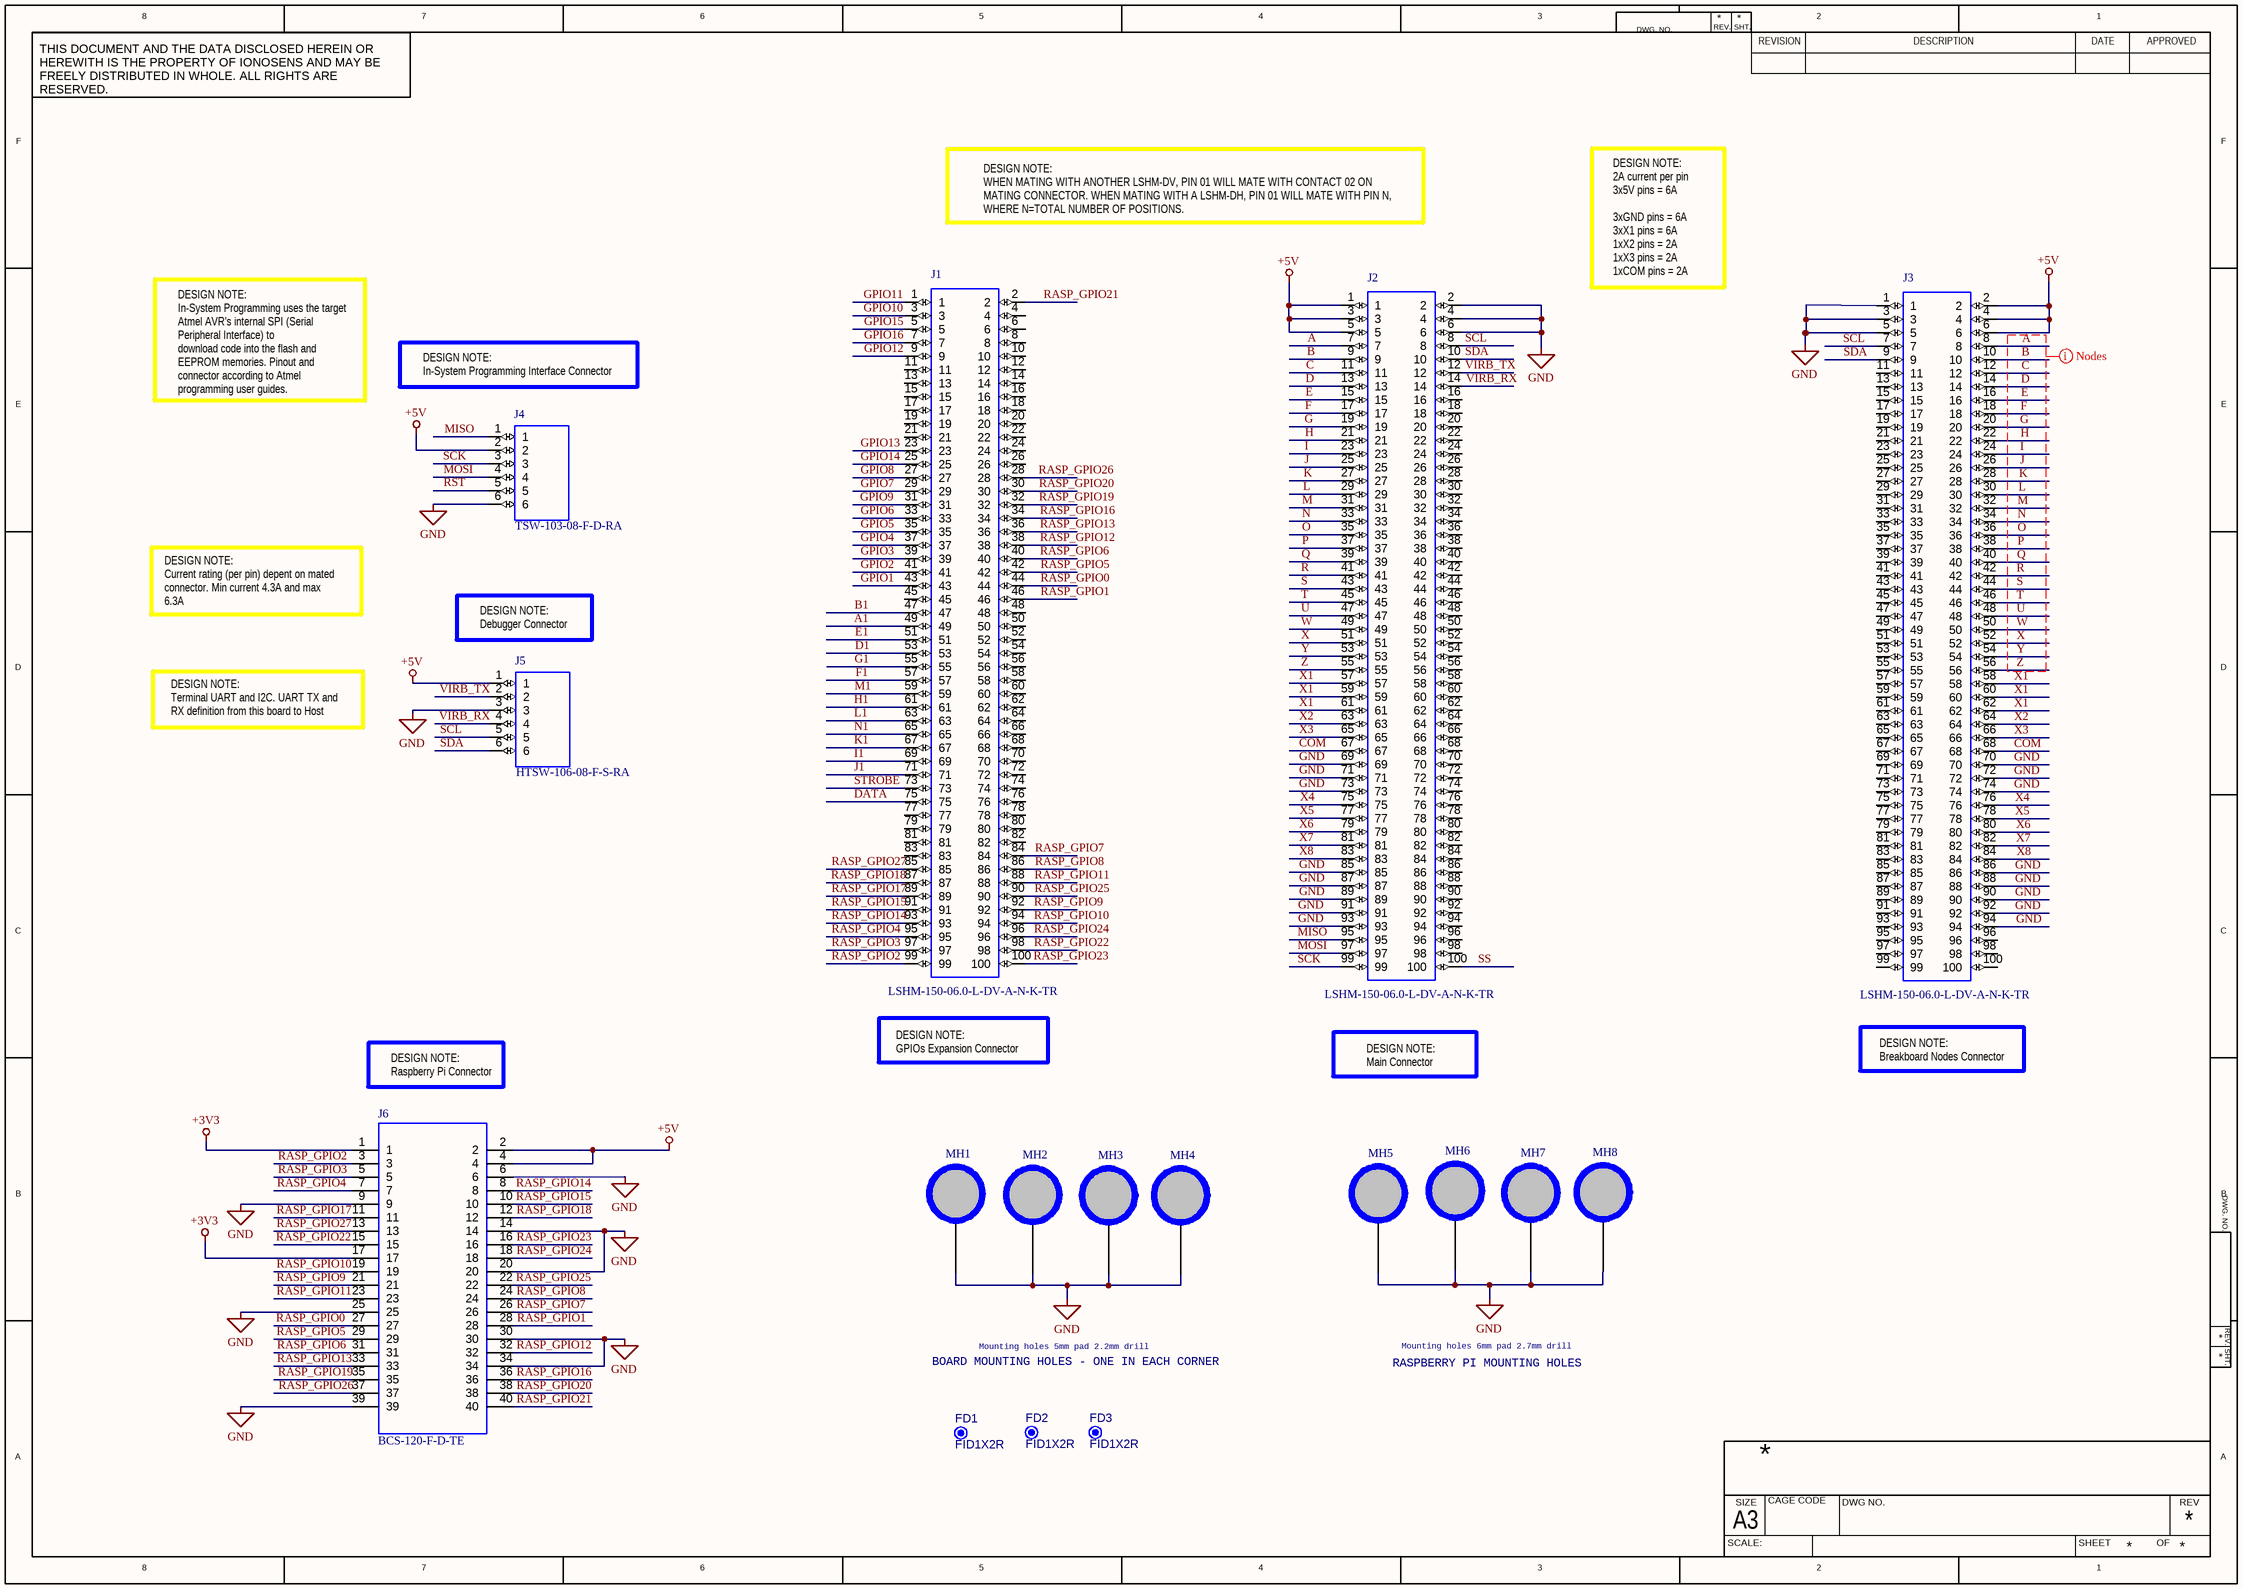
[diagram p2: Sheet3.SchDoc]

### Parts
FD1  FID1X2R  [FID1X2R]  (no BOM)
FD2  FID1X2R  [FID1X2R]  (no BOM)
FD3  FID1X2R  [FID1X2R]  (no BOM)
J1  LSHM-150-06.0-L-DV-A-N-K-TR  [LSHM_150_06_0_L_DV_A_N_K_TR]
J2  LSHM-150-06.0-L-DV-A-N-K-TR  [LSHM_150_06_0_L_DV_A_N_K_TR]
J3  LSHM-150-06.0-L-DV-A-N-K-TR  [LSHM_150_06_0_L_DV_A_N_K_TR]
J4  TSW-103-08-F-D-RA  [TSW-103-08-F-D-RA]
J5  HTSW-106-08-F-S-RA  [TSW-106-08-F-S-RA]
J6  BCS-120-F-D-TE  [BCS-120-F-D-TE]
MH1  C500h220  [C500h220z368]  (value not drawn)
MH2  C500h220  [C500h220z368]  (value not drawn)
MH3  C500h220  [C500h220z368]  (value not drawn)
MH4  C500h220  [C500h220z368]  (value not drawn)
MH5  C600h270  [C600h270z368]  (value not drawn)
MH6  C600h270  [C600h270z368]  (value not drawn)
MH7  C600h270  [C600h270z368]  (value not drawn)
MH8  C600h270  [C600h270z368]  (value not drawn)

### Nets
+3V3: J6.1 J6.17
+5V: J2.1 J2.3 J2.5 J3.2 J3.4 J3.6 J4.2 J5.1 J6.2 J6.4
GND: J2.2 J2.4 J2.6 J2.69 J2.71 J2.73 J2.85 J2.87 J2.89 J2.91 J2.93 J3.1 J3.3 J3.5 J3.70 J3.72 J3.74 J3.86 J3.88 J3.90 J3.92 J3.94 J4.6 J5.3 J6.6 J6.9 J6.14 J6.20 J6.25 J6.30 J6.34 J6.39 MH1.1 MH2.1 MH3.1 MH4.1 MH5.1 MH6.1 MH7.1 MH8.1
A: J2.7 J3.8
A1: J1.49
B: J2.9 J3.10
B1: J1.47
C: J2.11 J3.12
COM: J2.67 J3.68
D: J2.13 J3.14
D1: J1.53
DATA: J1.75
E: J2.15 J3.16
E1: J1.51
F: J2.17 J3.18
F1: J1.57
G: J2.19 J3.20
G1: J1.55
GPIO1: J1.43
GPIO2: J1.41
GPIO3: J1.39
GPIO4: J1.37
GPIO5: J1.35
GPIO6: J1.33
GPIO7: J1.29
GPIO8: J1.27
GPIO9: J1.31
GPIO10: J1.3
GPIO11: J1.1
GPIO12: J1.9
GPIO13: J1.23
GPIO14: J1.25
GPIO15: J1.5
GPIO16: J1.7
H: J2.21 J3.22
H1: J1.61
I: J2.23 J3.24
I1: J1.69
J: J2.25 J3.26
J1: J1.71
K: J2.27 J3.28
K1: J1.67
L: J2.29 J3.30
L1: J1.63
M: J2.31 J3.32
M1: J1.59
MISO: J2.95 J4.1
MOSI: J2.97 J4.4
N: J2.33 J3.34
N1: J1.65
O: J2.35 J3.36
P: J2.37 J3.38
Q: J2.39 J3.40
R: J2.41 J3.42
RASP_GPIO0: J1.44 J6.27
RASP_GPIO1: J1.46 J6.28
RASP_GPIO2: J1.99 J6.3
RASP_GPIO3: J1.97 J6.5
RASP_GPIO4: J1.95 J6.7
RASP_GPIO5: J1.42 J6.29
RASP_GPIO6: J1.40 J6.31
RASP_GPIO7: J1.84 J6.26
RASP_GPIO8: J1.86 J6.24
RASP_GPIO9: J1.92 J6.21
RASP_GPIO10: J1.94 J6.19
RASP_GPIO11: J1.88 J6.23
RASP_GPIO12: J1.38 J6.32
RASP_GPIO13: J1.36 J6.33
RASP_GPIO14: J1.93 J6.8
RASP_GPIO15: J1.91 J6.10
RASP_GPIO16: J1.34 J6.36
RASP_GPIO17: J1.89 J6.11
RASP_GPIO18: J1.87 J6.12
RASP_GPIO19: J1.32 J6.35
RASP_GPIO20: J1.30 J6.38
RASP_GPIO21: J1.2 J6.40
RASP_GPIO22: J1.98 J6.15
RASP_GPIO23: J1.100 J6.16
RASP_GPIO24: J1.96 J6.18
RASP_GPIO25: J1.90 J6.22
RASP_GPIO26: J1.28 J6.37
RASP_GPIO27: J1.85 J6.13
RST: J4.5
S: J2.43 J3.44
SCK: J2.99 J4.3
SCL: J2.8 J3.7 J5.5
SDA: J2.10 J3.9 J5.6
SS: J2.100
STROBE: J1.73
T: J2.45 J3.46
U: J2.47 J3.48
VIRB_RX: J2.14 J5.4
VIRB_TX: J2.12 J5.2
W: J2.49 J3.50
X: J2.51 J3.52
X1: J2.57 J2.59 J2.61 J3.58 J3.60 J3.62
X2: J2.63 J3.64
X3: J2.65 J3.66
X4: J2.75 J3.76
X5: J2.77 J3.78
X6: J2.79 J3.80
X7: J2.81 J3.82
X8: J2.83 J3.84
Y: J2.53 J3.54
Z: J2.55 J3.56

Not connected (* = marked no-connect by the designer): J1 4 6 8 10 11 12 13 14 15 16 17 18 19 20 21 22 24 26 45 48 50 52 54 56 58 60 62 64 66 68 70 72 74 76 77 78 79 80 81 82 83; J2 16 18 20 22 24 26 28 30 32 34 36 38 40 42 44 46 48 50 52 54 56 58 60 62 64 66 68 70 72 74 76 78 80 82 84 86 88 90 92 94 96 98; J3 11 13 15 17 19 21 23 25 27 29 31 33 35 37 39 41 43 45 47 49 51 53 55 57 59 61 63 65 67 69 71 73 75 77 79 81 83 85 87 89 91 93 95 96 97 98 99 100

### Layout directives
net class Nodes: A, B, C, D, E, F, G, H, I, J, K, L, M, N, O, P, Q, R, S, T, U, W, X, Y, Z

### Notes on the sheet
- DESIGN NOTE:
  WHEN MATING WITH ANOTHER LSHM-DV, PIN 01 WILL MATE WITH CONTACT 02 ON
  MATING CONNECTOR. WHEN MATING WITH A LSHM-DH, PIN 01 WILL MATE WITH PIN N,
  WHERE N=TOTAL NUMBER OF POSITIONS.
- DESIGN NOTE:
  2A current per pin
  3x5V pins = 6A
  3xGND pins = 6A
  3xX1 pins = 6A
  1xX2 pins = 2A
  1xX3 pins = 2A
  1xCOM pins = 2A
- DESIGN NOTE:
  In-System Programming uses the target Atmel AVR’s internal SPI (Serial Peripheral Interface) to
  download code into the flash and EEPROM memories. Pinout and connector according to Atmel programming user guides.
- DESIGN NOTE:
  In-System Programming Interface Connector
- DESIGN NOTE:
  Current rating (per pin) depent on mated connector. Min current 4.3A and max 6.3A
- (near J5) DESIGN NOTE:
  Debugger Connector
- DESIGN NOTE:
  Terminal UART and I2C. UART TX and RX definition from this board to Host
- DESIGN NOTE:
  GPIOs Expansion Connector
- DESIGN NOTE:
  Main Connector
- DESIGN NOTE:
  Breakboard Nodes Connector
- DESIGN NOTE:
  Raspberry Pi Connector
- BOARD MOUNTING HOLES - ONE IN EACH CORNER
- Mounting holes 5mm pad 2.2mm drill
- RASPBERRY PI MOUNTING HOLES
- Mounting holes 6mm pad 2.7mm drill
- 8
- 7
- 6
- 5
- 4
- 3
- DWG. NO.
- REV.
- SHT.
- REVISION
- 2
- DESCRIPTION
- DATE
- 1
- APPROVED
- THIS DOCUMENT AND THE DATA DISCLOSED HEREIN OR HEREWITH IS THE PROPERTY OF IONOSENS AND MAY BE FREELY DISTRIBUTED IN WHOLE. ALL RIGHTS ARE RESERVED.
- F
- E
- D
- C
- B
- A
- SCALE:
- A3
- SIZE
- CAGE CODE
- DWG NO.
- SHEET
- OF
- REV

### Library data of the parts
FD1-FD3 = CMP-00028-00005-2: Fiducial - Round 1x2mm; Pins: 0
J1-J3 = J01-001-01-00001-2: Conn Socket and Terminal Strip HDR/SKT 100 POS 0.5mm Solder ST SMD T/R; Manufacturer: Samtec; Gender: HERMAPHRODITIC; Pitch: 500 µm; Contact Plating: Gold; Case/Package: SMD; Max Operating Temperature: 125°C; Number of Rows: 2; RoHS Compliant: Yes; Housing Color: Black; Mounting Technology: SMD; Pins: 100; Termination: Solder; Orientation: Straight; Depth: 4.98 mm; Length: 29.7 mm; Contact Material: Bronze; Housing Material: Polymer; Min Operating Temperature: -55°C; Manufacturer P/N: LSHM-150-06.0-L-DV-A-N-K-TR
J4 = J01-001-01-00003-2: 6 Vias Pin Header 2.54mm, Right Angle; Manufacturer: Samtec; Gender: Male; Orientation: Straight; Mounting Technology: Through Hole; Contact Material: Bronze; Housing Material: Polyester; Pitch: 2.54mm; Housing Color: Black; Termination: Solder; Min Operating Temperature: -55°C; Pins: 6; Depth: 4.87 mm; RoHS Compliant: Yes; Manufacturer P/N: TSW-103-08-F-D-RA; Length: 7.62 mm; Contact Plating: Gold; Number of Rows: 2; Max Operating Temperature: 125°C; Case/Package: Through Hole
J5 = J01-001-01-00005-2: 6 Vias Pin Header 2.54mm, Right Angle, 1 Row; Manufacturer: Samtec; Gender: Male; Mounting Technology: Through Hole; RoHS Compliant: Yes; Contact Plating: Gold; Max Operating Temperature: 125°C; Pins: 6; Housing Material: Polyester; Case/Package: Through Hole; Pitch: 2.54mm; Contact Material: Bronze; Length: 7.62 mm; Termination: Solder; Number of Rows: 2; Manufacturer P/N: HTSW-106-08-F-S-RA; Depth: 4.87 mm; Orientation: Straight; Min Operating Temperature: -55°C; Housing Color: Black
J6 = J01-001-01-00010-2: Conn Socket Strip SKT 40 POS 2.54mm Solder ST Top Entry Thru-Hole TIGER CLAW™ Tube; Manufacturer: Samtec; Gender: Female; Pins: 40; Max Operating Temperature: 125°C; Manufacturer P/N: BCS-120-F-D-TE; Case/Package: Through Hole; Contact Material: -; Number of Rows: 2; Pitch: 2.54mm; Housing Material: -; Termination: Solder; RoHS Compliant: Yes; Contact Plating: Gold; Depth: -; Length: -; Housing Color: -; Orientation: -; Min Operating Temperature: -40°C; Mounting Technology: SMD
MH1-MH4 = CMP-00028-00007-2: hole 5mm pad drill 2.2; Manufacturer: Ionosens; Manufacturer P/N: H5D22; Mounting Technology: Pad; RoHS Compliant: yes; Case/Package: Pad; Min Operating Temperature: 125°C; Pins: 1; Max Operating Temperature: -40°C
MH5-MH8 = CMP-00028-00009-1: hole 6mm pad drill 2.7; RoHS Compliant: yes; Mounting Technology: Pad; Min Operating Temperature: 125°C; Case/Package: Pad; Max Operating Temperature: -40°C; Pins: 1

## Nets that join several sheets
+3V3: Sheet2 (K5.4), Sheet3 (J6.1 J6.17)
+5V: Sheet1 (32 pins), Sheet2 (33 pins), Sheet3 (10 pins)
GND: Sheet1 (45 pins), Sheet2 (28 pins), Sheet3 (40 pins)
A: Sheet2 (K1.1), Sheet3 (J2.7 J3.8)
A1: Sheet1 (U5.14 U6.14 U7.14 U8.7), Sheet2 (K1.4), Sheet3 (J1.49)
B: Sheet2 (K2.1), Sheet3 (J2.9 J3.10)
B1: Sheet1 (U5.13 U6.13 U7.13 U8.6), Sheet2 (K2.4), Sheet3 (J1.47)
C: Sheet2 (K8.1), Sheet3 (J2.11 J3.12)
C1: Sheet1 (U5.12 U6.12 U7.12 U8.5), Sheet2 (K8.4)
COIL0: Sheet1 (U12.14), Sheet2 (D4.1 K1.3)
COIL1: Sheet1 (U12.15), Sheet2 (D8.1 K2.3)
COIL2: Sheet1 (U12.12), Sheet2 (D12.1 K3.3)
COIL3: Sheet1 (U12.10), Sheet2 (D16.1 K4.3)
COIL4: Sheet1 (U11.13), Sheet2 (D5.1 K6.3)
COIL5: Sheet1 (U11.12), Sheet2 (D9.1 K7.3)
COIL6: Sheet1 (U12.16), Sheet2 (D13.1 K8.3)
COIL7: Sheet1 (U12.13), Sheet2 (D6.1 K9.3)
COIL8: Sheet1 (U12.11), Sheet2 (D10.1 K10.3)
COIL9: Sheet1 (U11.14), Sheet2 (D14.1 K11.3)
COIL10: Sheet1 (U11.11), Sheet2 (D17.1 K12.3)
COIL11: Sheet1 (U11.10), Sheet2 (D7.1 K13.3)
COIL12: Sheet1 (U13.15), Sheet2 (D11.1 K14.3)
COIL13: Sheet1 (U13.16), Sheet2 (D15.1 K15.3)
COIL14: Sheet1 (U11.15), Sheet2 (D18.1 K5.3)
COIL15: Sheet1 (U11.16), Sheet2 (D19.1 K16.3)
D: Sheet2 (K3.1), Sheet3 (J2.13 J3.14)
D1: Sheet1 (U5.16 U6.16 U7.16 U8.2), Sheet2 (K3.4), Sheet3 (J1.53)
DATA: Sheet1 (7 pins), Sheet3 (J1.75)
E: Sheet2 (K9.1), Sheet3 (J2.15 J3.16)
E1: Sheet1 (U5.15 U6.15 U7.15 U8.4), Sheet2 (K9.4), Sheet3 (J1.51)
F: Sheet2 (K10.1), Sheet3 (J2.17 J3.18)
F1: Sheet1 (U5.18 U6.18 U7.18 U10.7), Sheet2 (K10.4), Sheet3 (J1.57)
G: Sheet2 (K4.1), Sheet3 (J2.19 J3.20)
G1: Sheet1 (U5.17 U6.17 U7.17 U8.1), Sheet2 (K4.4), Sheet3 (J1.55)
GPIO1: Sheet1 (U4.13), Sheet3 (J1.43)
GPIO2: Sheet1 (U4.12), Sheet3 (J1.41)
GPIO3: Sheet1 (U4.9), Sheet3 (J1.39)
GPIO4: Sheet1 (U4.8), Sheet3 (J1.37)
GPIO5: Sheet1 (U4.7), Sheet3 (J1.35)
GPIO6: Sheet1 (U4.6), Sheet3 (J1.33)
GPIO7: Sheet1 (U4.5), Sheet3 (J1.29)
GPIO8: Sheet1 (U4.4), Sheet3 (J1.27)
GPIO9: Sheet1 (U4.1), Sheet3 (J1.31)
GPIO10: Sheet1 (U4.97), Sheet3 (J1.3)
GPIO11: Sheet1 (U4.96), Sheet3 (J1.1)
GPIO12: Sheet1 (U4.95), Sheet3 (J1.9)
GPIO13: Sheet1 (U4.94), Sheet3 (J1.23)
GPIO14: Sheet1 (U4.93), Sheet3 (J1.25)
GPIO15: Sheet1 (U4.92), Sheet3 (J1.5)
GPIO16: Sheet1 (U4.91), Sheet3 (J1.7)
H: Sheet2 (K11.1), Sheet3 (J2.21 J3.22)
H1: Sheet1 (U1.15 U2.16 U3.15 U9.6), Sheet2 (K11.4), Sheet3 (J1.61)
I: Sheet2 (K6.1), Sheet3 (J2.23 J3.24)
I1: Sheet1 (U1.17 U2.14 U3.17 U9.2), Sheet2 (K6.4), Sheet3 (J1.69)
J: Sheet2 (K12.1), Sheet3 (J2.25 J3.26)
J1: Sheet1 (U1.12 U2.12 U3.12 U10.2), Sheet2 (K12.4), Sheet3 (J1.71)
K: Sheet2 (K14.1), Sheet3 (J2.27 J3.28)
K1: Sheet1 (U1.18 U2.13 U3.18 U9.4), Sheet2 (K14.4), Sheet3 (J1.67)
L: Sheet2 (K13.1), Sheet3 (J2.29 J3.30)
L1: Sheet1 (U1.16 U2.15 U3.16 U9.7), Sheet2 (K13.4), Sheet3 (J1.63)
M: Sheet2 (K15.1), Sheet3 (J2.31 J3.32)
M1: Sheet1 (U1.14 U2.17 U3.14 U9.5), Sheet2 (K15.4), Sheet3 (J1.59)
MISO: Sheet1 (U4.22), Sheet3 (J2.95 J4.1)
MOSI: Sheet1 (U4.21), Sheet3 (J2.97 J4.4)
N: Sheet2 (K7.1), Sheet3 (J2.33 J3.34)
N1: Sheet1 (U1.13 U2.18 U3.13 U10.4), Sheet2 (K7.4), Sheet3 (J1.65)
RASP_GPIO0: Sheet1 (U5.22 U6.22), Sheet3 (J1.44 J6.27)
RASP_GPIO1: Sheet1 (U5.21 U6.21), Sheet3 (J1.46 J6.28)
RASP_GPIO2: Sheet1 (U2.20 U3.23), Sheet3 (J1.99 J6.3)
RASP_GPIO3: Sheet1 (U2.9 U3.22), Sheet3 (J1.97 J6.5)
RASP_GPIO4: Sheet1 (U2.21 U3.21), Sheet3 (J1.95 J6.7)
RASP_GPIO5: Sheet1 (U5.23 U6.23), Sheet3 (J1.42 J6.29)
RASP_GPIO6: Sheet1 (U5.9 U6.9), Sheet3 (J1.40 J6.31)
RASP_GPIO7: Sheet1 (U5.20 U6.20), Sheet3 (J1.84 J6.26)
RASP_GPIO8: Sheet1 (U1.23 U7.23), Sheet3 (J1.86 J6.24)
RASP_GPIO9: Sheet1 (U1.20 U7.20), Sheet3 (J1.92 J6.21)
RASP_GPIO10: Sheet1 (U1.9 U7.9), Sheet3 (J1.94 J6.19)
RASP_GPIO11: Sheet1 (U1.22 U7.22), Sheet3 (J1.88 J6.23)
RASP_GPIO12: Sheet1 (U5.8 U6.8), Sheet3 (J1.38 J6.32)
RASP_GPIO13: Sheet1 (U5.7 U6.7), Sheet3 (J1.36 J6.33)
RASP_GPIO14: Sheet1 (U2.8 U3.20), Sheet3 (J1.93 J6.8)
RASP_GPIO15: Sheet1 (U2.22 U3.6), Sheet3 (J1.91 J6.10)
RASP_GPIO16: Sheet1 (U5.6 U6.6), Sheet3 (J1.34 J6.36)
RASP_GPIO17: Sheet1 (U2.7 U3.7), Sheet3 (J1.89 J6.11)
RASP_GPIO18: Sheet1 (U2.23 U3.8), Sheet3 (J1.87 J6.12)
RASP_GPIO22: Sheet1 (U1.7 U7.7), Sheet3 (J1.98 J6.15)
RASP_GPIO23: Sheet1 (U1.6 U7.6), Sheet3 (J1.100 J6.16)
RASP_GPIO24: Sheet1 (U1.8 U7.8), Sheet3 (J1.96 J6.18)
RASP_GPIO25: Sheet1 (U1.21 U7.21), Sheet3 (J1.90 J6.22)
RASP_GPIO27: Sheet1 (U2.6 U3.9), Sheet3 (J1.85 J6.13)
RST: Sheet1 (R1.1 U4.30), Sheet3 (J4.5)
SCK: Sheet1 (U4.20), Sheet3 (J2.99 J4.3)
SCL: Sheet1 (U4.43), Sheet3 (J2.8 J3.7 J5.5)
SDA: Sheet1 (U4.44), Sheet3 (J2.10 J3.9 J5.6)
SS: Sheet1 (U4.19), Sheet3 (J2.100)
STROBE: Sheet1 (7 pins), Sheet3 (J1.73)
VIRB_RX: Sheet1 (U4.2), Sheet3 (J2.14 J5.4)
VIRB_TX: Sheet1 (U4.3), Sheet3 (J2.12 J5.2)
X4: Sheet2 (K5.1), Sheet3 (J2.75 J3.76)
X5: Sheet2 (K16.1), Sheet3 (J2.77 J3.78)